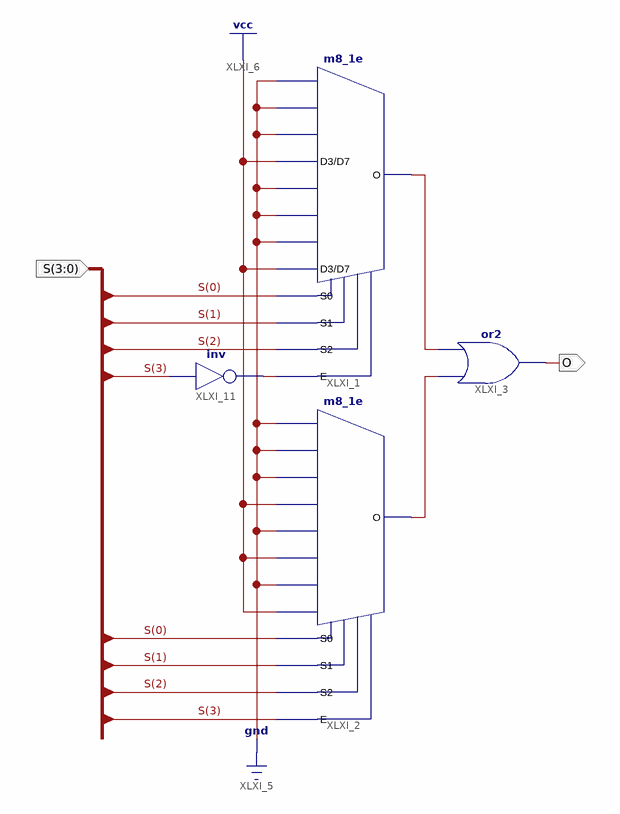
[diagram p0: schematic sheet 1]
// Xilinx ISE schematic schematic.sch (spartan3e) as structural Verilog: 4 symbols, 2 ports
module schematic (
  input  [3:0] S,
  output O
);

  wire XLXN_1, XLXN_2, XLXN_37;

  m8_1e XLXI_1 (
    .D0(1'b0), .D1(1'b0), .D2(1'b0), .D3(1'b1), .D4(1'b0), .D5(1'b0), .D6(1'b0), .D7(1'b1), .E(XLXN_37),
    .S0(S[0]), .S1(S[1]), .S2(S[2]), .O(XLXN_1));
  m8_1e XLXI_2 (
    .D0(1'b0), .D1(1'b0), .D2(1'b0), .D3(1'b1), .D4(1'b0), .D5(1'b1), .D6(1'b0), .D7(1'b1), .E(S[3]),
    .S0(S[0]), .S1(S[1]), .S2(S[2]), .O(XLXN_2));
  or XLXI_3 (O, XLXN_2, XLXN_1);
  not XLXI_11 (XLXN_37, S[3]);
endmodule
